# EAGLE schematic SHIELD_TEST_INPUT (EAGLE 9.6.2)
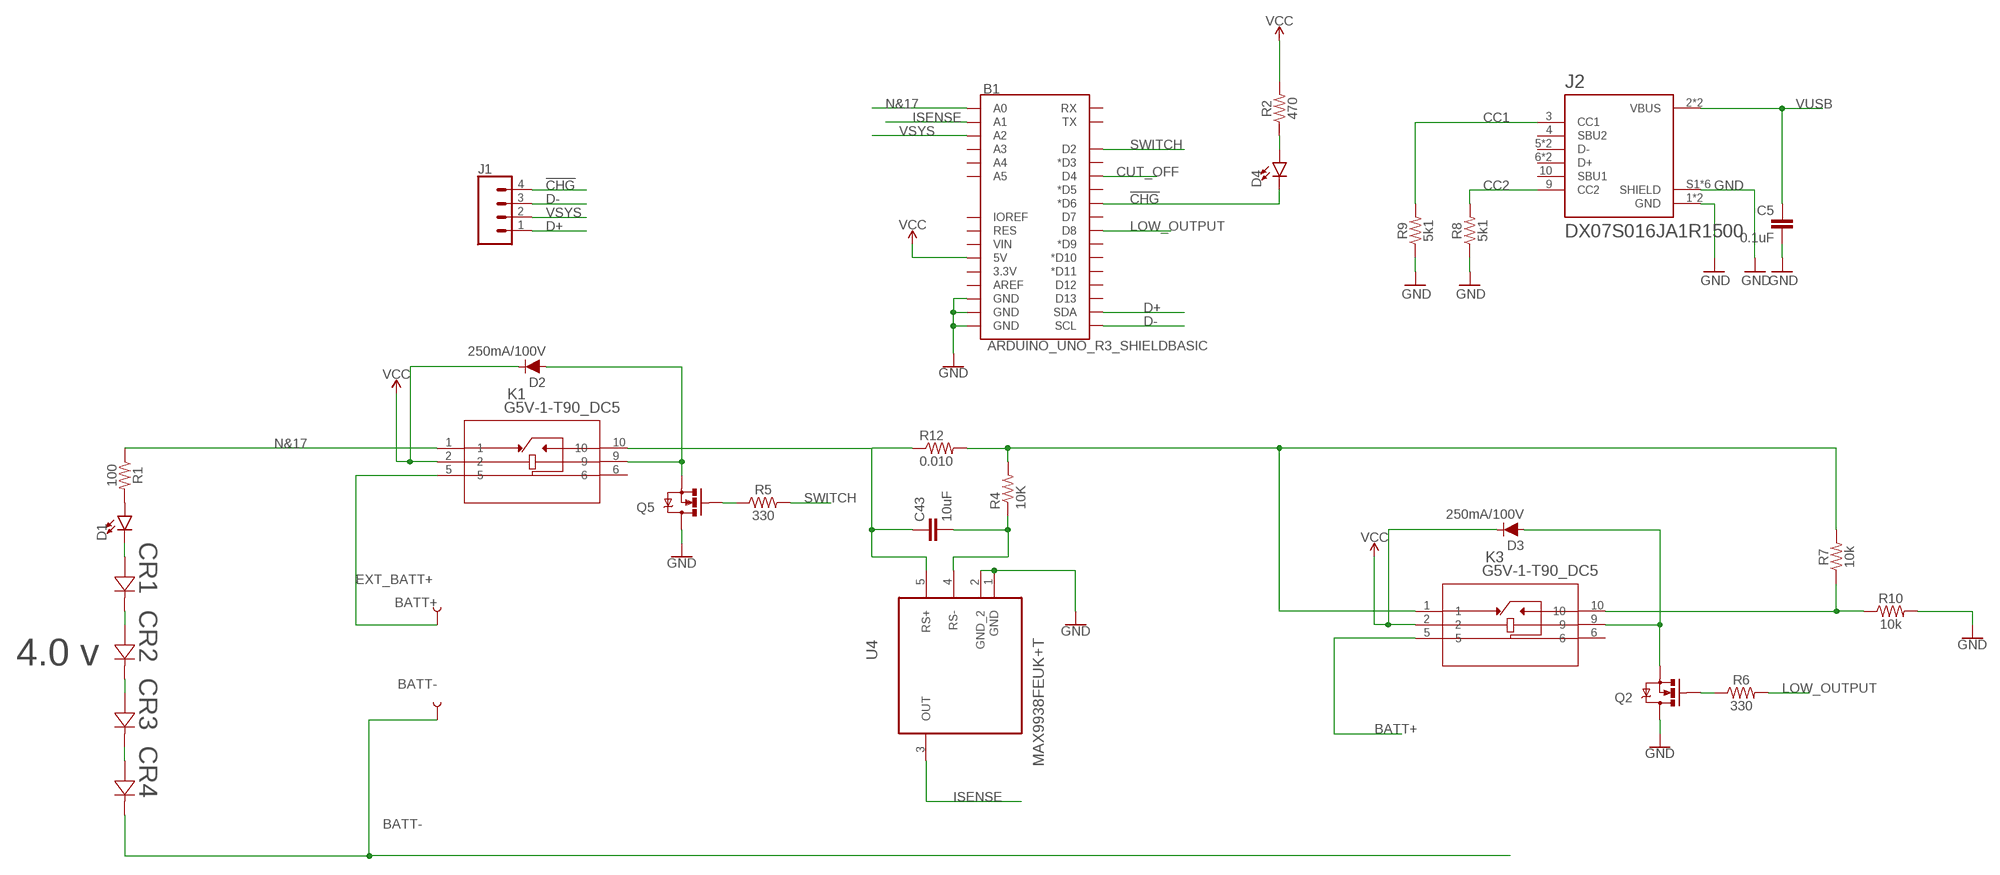
[diagram p0: schematic, sheet 1]

## Parts
B1  ARDUINO_UNO_R3_SHIELDBASIC  [UNO_R3_SHIELD]
BATT+  TEST-POINT2  [PAD.02X.02]
BATT-  TEST-POINT2  [PAD.02X.02]
C5  0.1uF  0.1UF-0603-25V-(+80/-20%)  [0603]
C43  10uF  CAP1206  [1206]
CR1  1N4148WSF-7  [SOD323F_DIO]
CR2  1N4148WSF-7  [SOD323F_DIO]
CR3  1N4148WSF-7  [SOD323F_DIO]
CR4  1N4148WSF-7  [SOD323F_DIO]
D1  LED0603  [LED-0603]
D2  250mA/100V  DIODE-BAS16J  [SOD-323]
D3  250mA/100V  DIODE-BAS16J  [SOD-323]
D4  LED0603  [LED-0603]
J1  CONN_04  [1X04]
J2  DX07S016JA1R1500  [JAE_DX07S016JA1R1500]
K1  G5V-1-T90_DC5  [RELAY_G5V-1_OMR]
K3  G5V-1-T90_DC5  [RELAY_G5V-1_OMR]
Q2  2N7002PW  MOSFET-NCHANNEL2N7002PW  [SOT323]
Q5  2N7002PW  MOSFET-NCHANNEL2N7002PW  [SOT323]
R1  100  RESISTOR0805  [0805]
R2  470  RESISTOR0805  [0805]
R4  10K  RESISTOR0805-RES  [0805]
R5  330  RESISTOR0805  [0805]
R6  330  RESISTOR0805  [0805]
R7  10k  RESISTOR0805  [0805]
R8  5k1  RESISTOR0805  [0805]
R9  5k1  RESISTOR0805  [0805]
R10  10k  RESISTOR0805  [0805]
R12  0.010  RESISTOR1206  [1206]
U4  MAX9938FEUK+T  [SOT95P280X145-5N]

## Nets
!CHG: B1.D6(*D6) D4.C J1.4
BATT+: K3.5
BATT-: BATT-.P$1 CR4.1
CC1: J2.3(CC1) R9.2
CC2: J2.9(CC2) R8.2
CUT_OFF: B1.D4
D+: B1.SDA J1.1
D-: B1.SCL J1.3
EXT_BATT+: BATT+.P$1 K1.5
EXT_BATT+1: K3.1 R4.2 R7.2 R12.2
GND: B1.GND@0(GND) B1.GND@1(GND) B1.GND@2(GND) C5.2 J2.1(GND) J2.12(GND) J2.S1(SHIELD) J2.S2(SHIELD) J2.S3(SHIELD) J2.S4(SHIELD) J2.S5(SHIELD) J2.S6(SHIELD) Q2.3(D) Q5.3(D) R8.1 R9.1 R10.2 U4.1(GND) U4.2(GND_2)
ISENSE: B1.A1 U4.3(OUT)
LOW_OUTPUT: B1.D8 R6.2
N$1: CR1.2 D1.C
N$2: CR1.1 CR2.2
N$3: D1.A R1.2
N$4: CR2.1 CR3.2
N$5: D4.A R2.1
N$6: CR3.1 CR4.2
N$7: D3.A K3.9 Q2.2(S)
N$9: Q2.1(G) R6.1
N$10: C43.2 R4.1 U4.4(RS-)
N$11: Q5.1(G) R5.1
N$12: D2.A K1.9 Q5.2(S)
N&17: B1.A0 K1.1 R1.1
SWITCH: B1.D2 R5.2
VCC: B1.5V D2.C D3.C K1.2 K3.2 R2.2
VO_TPS: C43.1 K1.10 R12.1 U4.5(RS+)
VO_TPS1: K3.10 R7.1 R10.1
VSYS: B1.A2 J1.2
VUSB: C5.1 J2.2(VBUS) J2.11(VBUS)
Unconnected: B1.3.3V B1.A3 B1.A4 B1.A5 B1.AREF B1.D3(*D3) B1.D5(*D5) B1.D7 B1.D9(*D9) B1.D10(*D10) B1.D11(*D11) B1.D12 B1.D13 B1.IOREF B1.RES B1.RX B1.TX B1.VIN J2.4(SBU2) J2.5(D-) J2.6(D+) J2.7(D+) J2.8(D-) J2.10(SBU1) K1.6 K3.6

## Notes on the sheet
- 4.0 v

## Library data of the parts
B1 = SparkFun-Boards:ARDUINO_UNO_R3_SHIELD: Arduino R3 Shield Footprint Shield form compatible with the Arduino Uno R3. SparkFun Products: MG2639 Cellular Shield <https://www.sparkfun.com/products/13120> MIDI Shield <https://www.sparkfun.com/products/12898> R3 Stackable Headers Kit <https://www.sparkfun.com/products/11417>
BATT+ BATT- = SparkFun-Connectors:TEST-POINT: SparkFun Test Points Bare copper test points for troubleshooting or In-Circuit-Testing. These are used by our Production team for verifying production board runs using pogo-pins on test beds. SparkFun Products: SparkFun LSM9DS1 Breakout <https://www.sparkfun.com/products/13284> SparkFun PSOC <https://www.sparkfun.com/products/13714> SparkFun Load Cell Amplifier <https://www.sparkfun.com/products/13879>
C5 = SparkFun-Capacitors:0.1UF: 0.1µF ceramic capacitors A capacitor is a passive two-terminal electrical component used to store electrical energy temporarily in an electric field.; PROD_ID: CAP-00810
C43 = SparkFun-Passives:CAP: Capacitor Standard 0603 ceramic capacitor, and 0.1" leaded capacitor.
CR1-CR4 = 1n4148:1N4148WSF-7; COPYRIGHT: Copyright (C) 2021 Ultra Librarian. All rights reserved.; DIGI-KEY_PART_NUMBER_1: 1N4148WSF-7DI-ND; DIGI-KEY_PART_NUMBER_2: 1N4148WSF-7DICT-ND; DIGI-KEY_PART_NUMBER_3: 1N4148WSF-7DIDKR-ND; DIGI-KEY_PART_NUMBER_4: 1N4148WSF-7DITR-ND; MANUFACTURER_PART_NUMBER: 1N4148WSF-7; MFR_NAME: Diodes Inc
D1 D4 = SparkFun-LED:LED: LED (Generic) Standard schematic elements and footprints for 5mm, 3mm, 1206, and 0603 sized LEDs. Generic LEDs with no color specified.
D2 D3 = SparkFun-DiscreteSemi:DIODE: Diode These are standard reverse protection diodes and small signal diodes. SparkFun Products: SparkFun SparkPunk Sound Kit <https://www.sparkfun.com/products/11177> SparkFun ESP8266 Thing <https://www.sparkfun.com/products/13231>; PROD_ID: DIO-09646
J1 = SparkFun-Connectors:CONN_04: Multi connection point. Often used as Generic Header-pin footprint for 0.1 inch spaced/style header connections On any of the 0.1 inch spaced packages, you can populate with these: Break Away Headers - Straight <https://www.sparkfun.com/products/116> (PRT-00116) Break Away Male Headers - Right Angle <https://www.sparkfun.com/products/553> (PRT-00553) Female Headers <https://www.sparkfun.com/products/115> (PRT-00115) Break Away Headers - Machine Pin <https://www.sparkfun.com/products/117> (PRT-00117) Break Away Female Headers - Swiss Machine Pin <https://www.sparkfun.com/products/743> (PRT-00743) For SCREWTERMINALS and SPRING TERMINALS visit here: Screw Terimnals on SparkFun.com <https://www.sparkfun.com/search/results?term=Screw+Terminals> (5mm/3.5mm/2.54mm spacing) This device is also useful as a general connection point to wire up your design to another part of your project. Our various solder wires solder well into these plated through hole pads. Hook-Up Wire - Assortment (Stranded, 22 AWG) <https://www.sparkfun.com/products/11375> (PRT-11375) Hook-Up Wire - Assortment (Solid Core, 22 AWG) <https://www.sparkfun.com/products/11367> (PRT-11367) View the entire wire category on our website here <https://www.sparkfun.com/categories/141> Special notes: Molex polarized connector foot print use with SKU : PRT-08231 with associated crimp pins and housings. 1MM SMD Version SKU: PRT-10208; PROD_ID: CONN-09696
J2 = DX07S016JA1R1500:DX07S016JA1R1500: USB-C (USB TYPE-C) USB 2.0 Receptacle Connector 24 (16+8 Dummy) Position Surface Mount, Right Angle; Through Hole; DESCRIPTION: USB-C (USB TYPE-C) USB 2.0 Receptacle Connector 24 (16+8 Dummy) Position Surface Mount, Right Angle; Through Hole; DIGI-KEY_PART_NUMBER: 670-DX07S016JA1R1500CT-ND; MF: JAE Electronics; MP: DX07S016JA1R1500; PACKAGE: None; PURCHASE-URL: https://pricing.snapeda.com/search/part/DX07S016JA1R1500/?ref=eda
K1 K3 = Rele:G5V-1-T90_DC5; COPYRIGHT: Copyright (C) 2021 Ultra Librarian. All rights reserved.; DIGI-KEY_PART_NUMBER_1: Z6370-ND; MANUFACTURER_PART_NUMBER: G5V-1-T90 DC5; MFR_NAME: Omron
Q2 Q5 = SparkFun-DiscreteSemi:MOSFET-NCHANNEL: Common NMOSFET Parts MFG P/N Store ID Prod ID FDD8780 TRANS-09984 SI7820DN TRANS-11055 FDS6630A IC-08089 2N7002PW TRANS-11151 FQP30N06L COM-10213 TRANS-10060 BSS123LT1G TRANS-08345 BSS138 TRANS-00830 BS170 2N7000; PROD_ID: TRANS-11151
R1 R2 R5-R10 R12 = SparkFun-Resistors:RESISTOR: Generic Resistor Package
R4 = SparkFun:RESISTOR: Resistor Basic schematic elements and footprints for 0603, 1206, and PTH resistors.
U4 = MAX9938:MAX9938FEUK+T; DESCRIPTION: Precision Current-Sense Amplifier; MPN: MAX9938FEUK+T; OC_FARNELL: -; OC_NEWARK: 01N6733; PACKAGE: SOT-23-5; SUPPLIER: Maxim